# Altium schematic sheet 11-mppt.SchDoc: MPPT
size Letter; DrawnBy: J. Brinton; Engineer: J. Brinton; Revision: 1; SheetNumber: 11; SheetTotal: 14
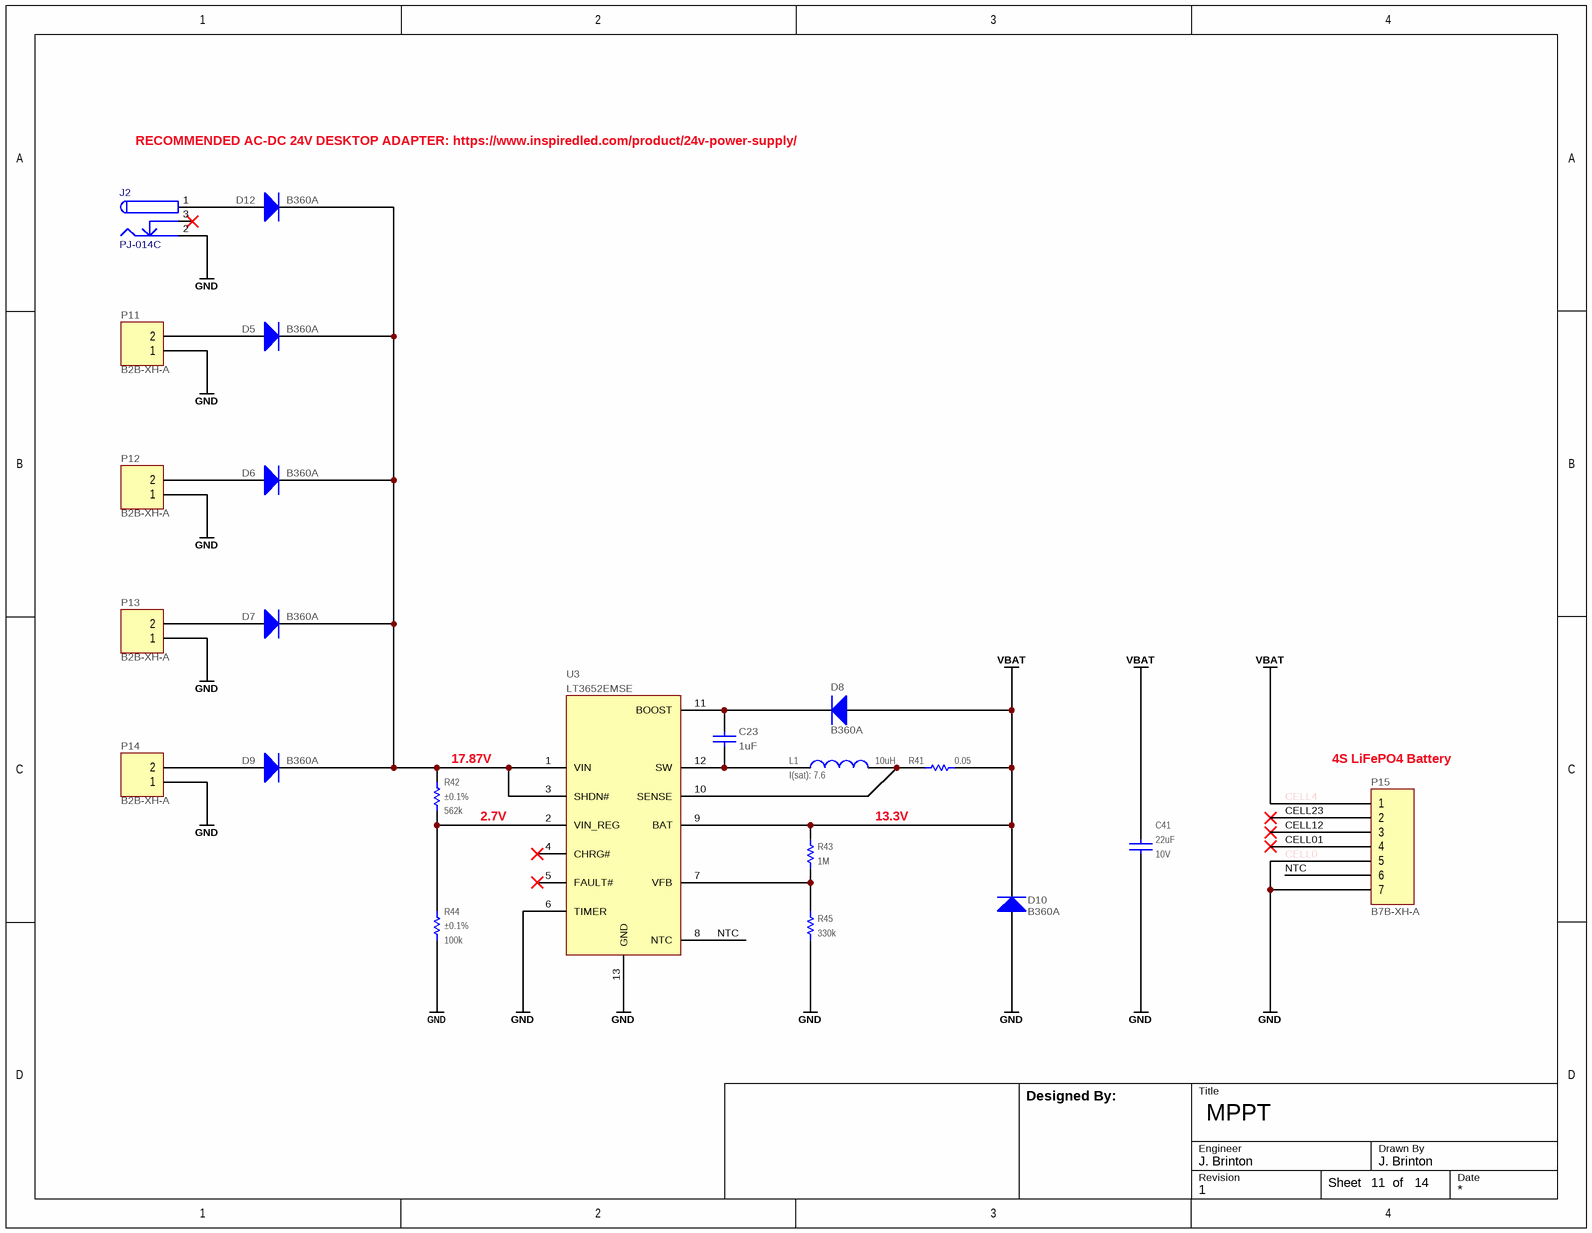
[diagram p0: 11-mppt.SchDoc]

## Parts
C23  value 1uF  [CAPC200X125X145L45N]  (hidden comment: TMK212B7105KG)
C41  value 22uF  Voltage: 10V  [CAPC200X125X145L45N]  (hidden comment: C2012X7S1A226M125)
D5  B360A  [SMA]
D6  B360A  [SMA]
D7  B360A  [SMA]
D8  B360A  [SMA]
D9  B360A  [SMA]
D10  B360A  [SMA]
D12  B360A  [SMA]
J2  PJ-014C  [PJ-014C]
L1  value 10uH  I(sat): 7.6  [XAL6030]  (hidden comment: XAL6030-103ME)
P11  B2B-XH-A  [B2B-XH-A]
P12  B2B-XH-A  [B2B-XH-A]
P13  B2B-XH-A  [B2B-XH-A]
P14  B2B-XH-A  [B2B-XH-A]
P15  B7B-XH-A  [B7B-XH-A]
R41  value 0.05  [RESC2012X70N]  (hidden comment: ERJ-6BWFR050V)
R42  value 562k  Tolerance: ±0.1%  [RESC2012X70N]  (hidden comment: ERA-6AEB5623V)
R43  value 1M  [RESC2012X70N]  (hidden comment: ERJ-6ENF1004V)
R44  value 100k  Tolerance: ±0.1%  [RESC2012X70N]  (hidden comment: ERA-6AEB104V)
R45  value 330k  [RESC2012X70N]  (hidden comment: ERJ-6ENF3303V)
U3  LT3652EMSE  [12-MSOP-EP]

## Nets
GND: C41.1 D10.1(A) J2.2 P11.1 P12.1 P13.1 P14.1 P15.5 P15.7 R44.1 R45.1 U3.6(TIMER) U3.13(GND)
VBAT: C41.2 D8.1(A) D10.2(K) P15.1 R41.1 R43.2 U3.9(BAT)
CELL01: P15.4
CELL12: P15.3
CELL23: P15.2
NTC: P15.6 U3.8(NTC)
NetC23_1: C23.1 D8.2(K) U3.11(BOOST)
NetC23_2: C23.2 L1.1 U3.12(SW)
NetD5_1: D5.1(A) P11.2
NetD5_2: D5.2(K) D6.2(K) D7.2(K) D9.2(K) D12.2(K) R42.2 U3.1(VIN) U3.3(SHDN#)
NetD6_1: D6.1(A) P12.2
NetD7_1: D7.1(A) P13.2
NetD9_1: D9.1(A) P14.2
NetD12_1: D12.1(A) J2.1
NetL1_2: L1.2 R41.2 U3.10(SENSE)
NetR42_1: R42.1 R44.2 U3.2(VIN_REG)
NetR43_1: R43.1 R45.2 U3.7(VFB)

Not connected (* = marked no-connect by the designer): J2 3*; U3 4(CHRG#)* 5(FAULT#)*

## Notes on the sheet
- RECOMMENDED AC-DC 24V DESKTOP ADAPTER: https://www.inspiredled.com/product/24v-power-supply/
- (near R42) 17.87V
- 2.7V
- 13.3V
- CELL4
- (near P15) 4S LiFePO4 Battery
- CELL0
- Designed By:
- Title
- Engineer
- Revision
- Drawn By
- Date
- Sheet
- of

## Library data of the parts
C23 = TMK212B7105KG: Ceramic Capacitor 1uF ±10% 25V X7R 0805; Manufacturer: Taiyo Yuden; Tr: -55:125; Manufacturer P/N: TMK212B7105KG; Tolerance: ±10%; Package: 0805; Voltage: 25V
C41 = CAP: Ceramic Capacitor 22uF ±20% 10V X7S 0805; Manufacturer: TDK; Tr: -55:125; Manufacturer P/N: C2012X7S1A226M125; Tolerance: ±20%; Package: 0805
D5-D10 D12 = D360A: DIODE SCHOTTKY 60V 3A SMA; Manufacturer: Diodes Inc; Tr: -55:150; Manufacturer P/N: B360A; Current: 3A; Reverse Voltage (max): 60V; Package: SMA
J2 = PJ-014C: DC Power Jack; Manufacturer: CUI; ComponentLink1Description: Manufacturer Link; ComponentLink1URL: http://domino.kycon.com/internet/Products.html; Manufacturer P/N: PJ-014C
L1 = INDUCTOR: Shielded Power Inductor 10uH, 7.6A; Manufacturer: Coilcraft; Manufacturer P/N: XAL6030-103ME
P11-P14 = Header 2: Header, 2-Pin; Manufacturer: JST; Manufacturer P/N: B2B-XH-A
P15 = Header 7: Header, 7-Pin; Manufacturer: JST; Manufacturer P/N: B7B-XH-A
R41 = RES 0402: Thick Film Resistor 0.05 ±1% 0805; Manufacturer: Panasonic; Tr: -55:155; Package: 0805; Manufacturer P/N: ERJ-6BWFR050V; Tolerance: ±1%
R42 = RES: Thin Film Resistor 562k ±0.1% 0.125W 100V 0805; Manufacturer: Panasonic; Tcr: ±25; Tr: -55:155; Voltage: 100; Power: 0.125; Manufacturer P/N: ERA-6AEB5623V; Package: 0805
R43 = RES 0402: Thick Film Resistor 1M ±1% 0805; Manufacturer: Panasonic; Tr: -55:155; Package: 0805; Manufacturer P/N: ERJ-6ENF1004V; Tolerance: ±1%
R44 = RES: Thin Film Resistor 100k ±0.1% 0.125W 100V 0805; Manufacturer: Panasonic; Tcr: ±25; Tr: -55:155; Voltage: 100; Power: 0.125; Manufacturer P/N: ERA-6AEB104V; Package: 0805
R45 = RES 0402: Thick Film Resistor 330k ±1% 0805; Manufacturer: Panasonic; Tr: -55:155; Package: 0805; Manufacturer P/N: ERJ-6ENF3303V; Tolerance: ±1%
U3 = LT3652EMSE: Power Tracking 2A Battery Charger for Solar Power; Manufacturer: Analog Devices; Manufacturer P/N: LT3652EMSE